# EAGLE design fade4 (EAGLE 9.6.2)

## Sheet 1 of 2
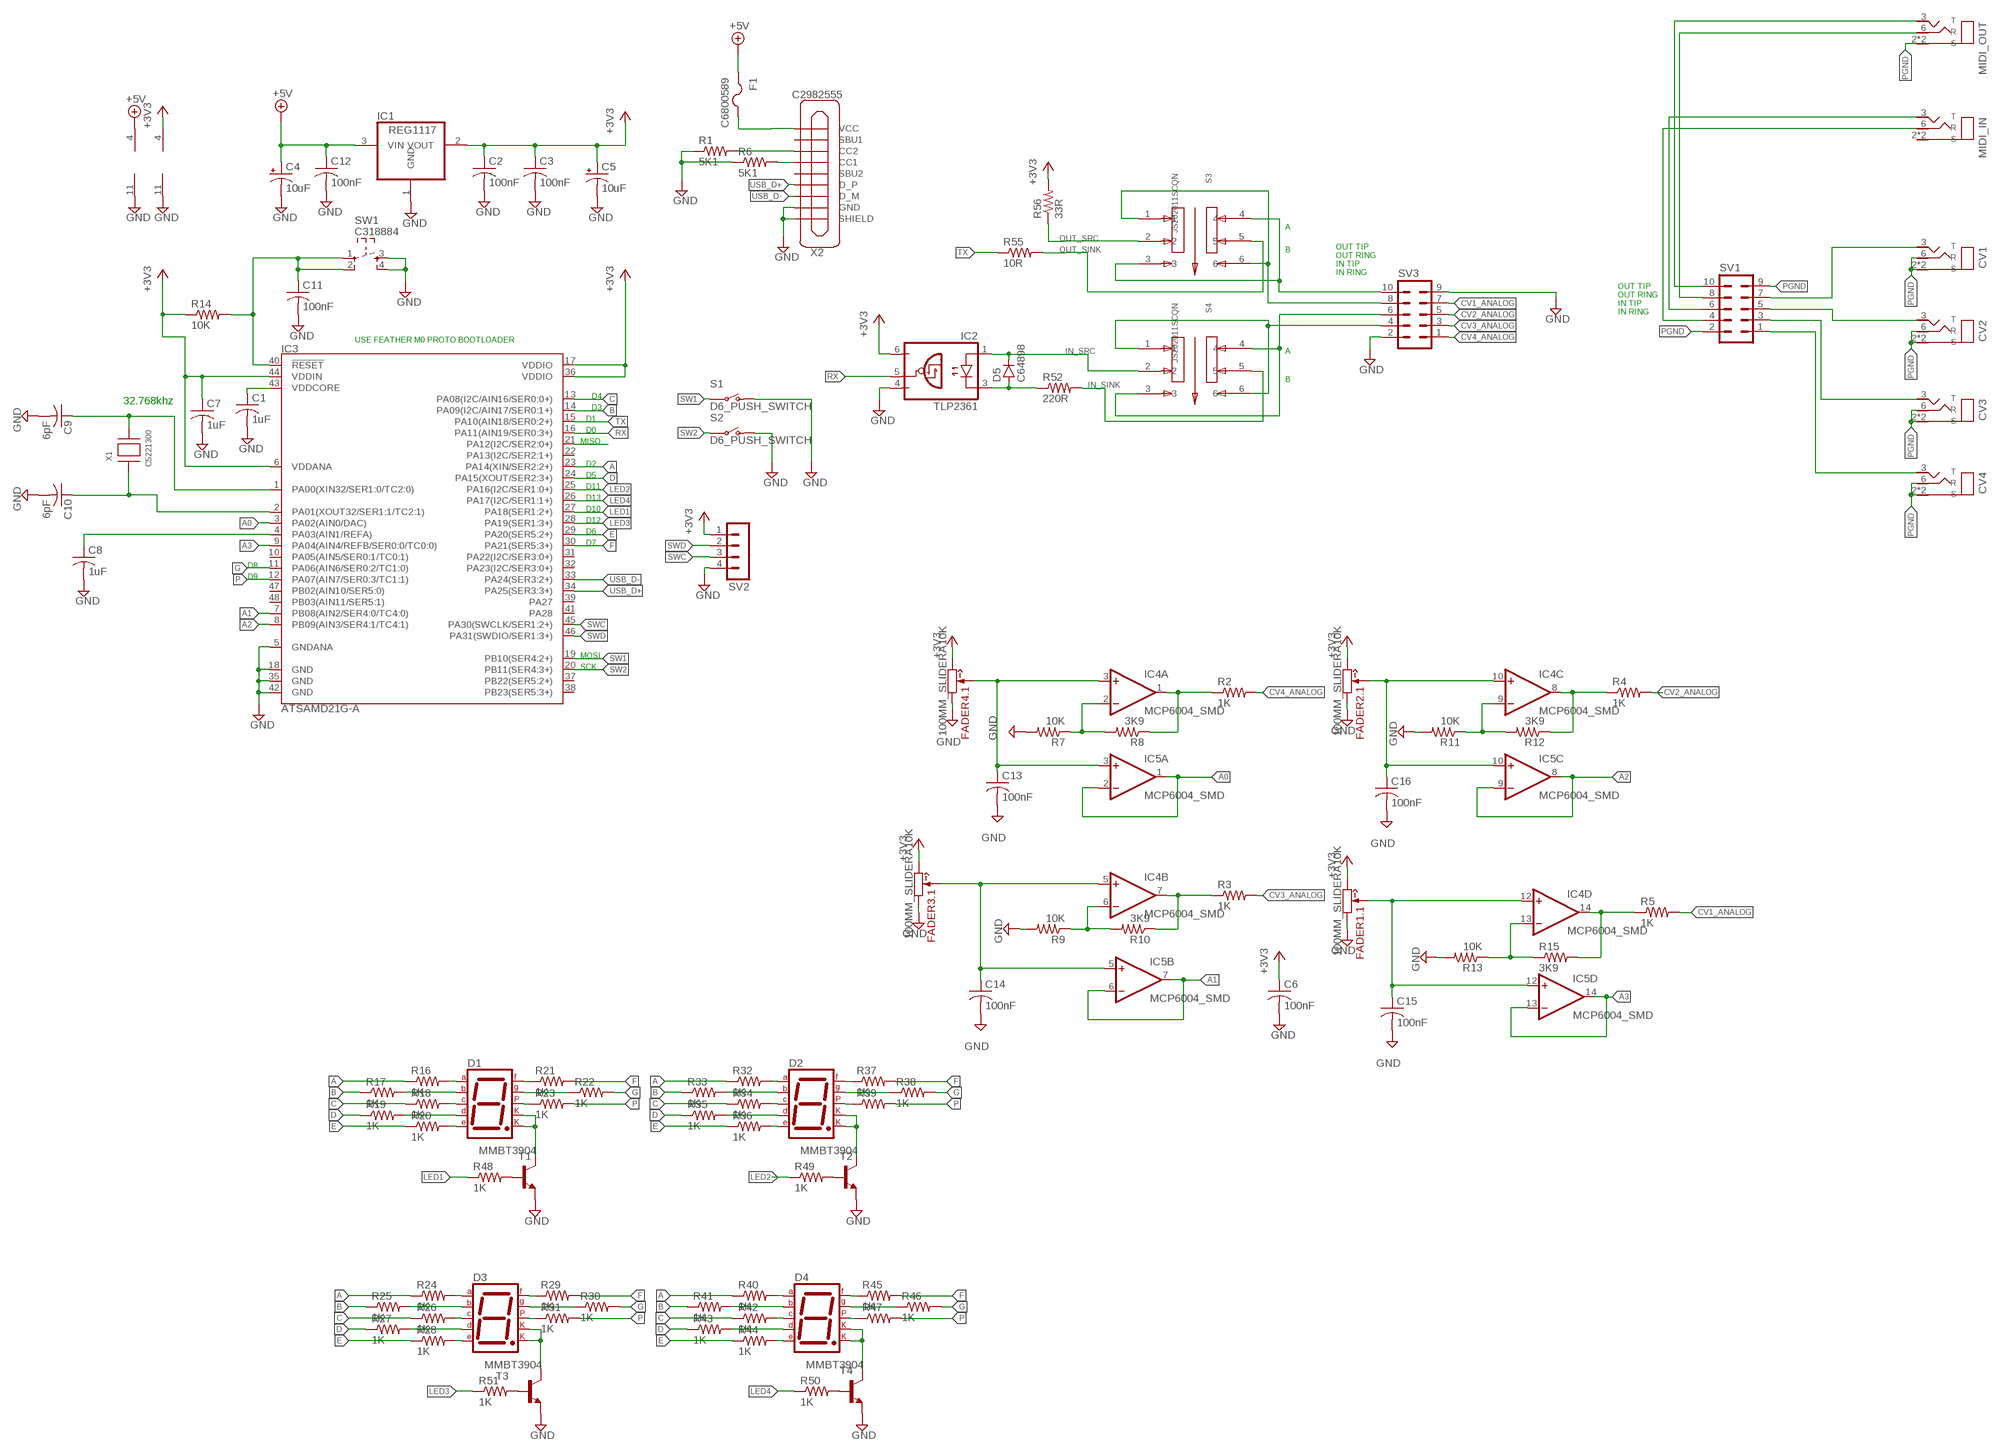
[diagram p0: schematic, sheet 1]

### Parts
C1  1uF  C-USC0603K  [C0603K]
C2  100nF  C-USC0603K  [C0603K]
C3  100nF  C-USC0603K  [C0603K]
C4  10uF  CPOL-USA/3216-18R  [A/3216-18R]
C5  10uF  CPOL-USA/3216-18R  [A/3216-18R]
C6  100nF  C-USC0603K  [C0603K]
C7  1uF  C-USC0603K  [C0603K]
C8  1uF  C-USC0603K  [C0603K]
C9  6pF  C-USC0603K  [C0603K]
C10  6pF  C-USC0603K  [C0603K]
C11  100nF  C-USC0603K  [C0603K]
C12  100nF  C-USC0603K  [C0603K]
C13  100nF  C-USC0603K  [C0603K]
C14  100nF  C-USC0603K  [C0603K]
C15  100nF  C-USC0603K  [C0603K]
C16  100nF  C-USC0603K  [C0603K]
CV1  C725772  [C725772]
CV2  C725772  [C725772]
CV3  C725772  [C725772]
CV4  C725772  [C725772]
D1  7SEG-CK  [7SEG-13]
D2  7SEG-CK  [7SEG-13]
D3  7SEG-CK  [7SEG-13]
D4  7SEG-CK  [7SEG-13]
D5  C64898  D-SOD123  [SOD123]
F1  C6800589  PTCFUSE-1206  [R1206]
FADER1  100MM_SLIDERA10K  [100MM-SLIDER]
FADER2  100MM_SLIDERA10K  [100MM-SLIDER]
FADER3  100MM_SLIDERA10K  [100MM-SLIDER]
FADER4  100MM_SLIDERA10K  [100MM-SLIDER]
IC1  REG1117  [SOT223]
IC2  TLP2361  [SOIC-5]
IC3  ATSAMD21G-A  [TQFP-48]
IC4  MCP6004_SMD  [SO14]
IC5  MCP6004_SMD  [SO14]
MIDI_IN  C725772  [C725772]
MIDI_OUT  C725772  [C725772]
R1  5K1  R-US_R0603  [R0603]
R2  1K  R-US_R0603  [R0603]
R3  1K  R-US_R0603  [R0603]
R4  1K  R-US_R0603  [R0603]
R5  1K  R-US_R0603  [R0603]
R6  5K1  R-US_R0603  [R0603]
R7  10K  R-US_R0603  [R0603]
R8  3K9  R-US_R0603  [R0603]
R9  10K  R-US_R0603  [R0603]
R10  3K9  R-US_R0603  [R0603]
R11  10K  R-US_R0603  [R0603]
R12  3K9  R-US_R0603  [R0603]
R13  10K  R-US_R0603  [R0603]
R14  10K  R-US_R0603  [R0603]
R15  3K9  R-US_R0603  [R0603]
R16  1K  R-US_R0603  [R0603]
R17  1K  R-US_R0603  [R0603]
R18  1K  R-US_R0603  [R0603]
R19  1K  R-US_R0603  [R0603]
R20  1K  R-US_R0603  [R0603]
R21  1K  R-US_R0603  [R0603]
R22  1K  R-US_R0603  [R0603]
R23  1K  R-US_R0603  [R0603]
R24  1K  R-US_R0603  [R0603]
R25  1K  R-US_R0603  [R0603]
R26  1K  R-US_R0603  [R0603]
R27  1K  R-US_R0603  [R0603]
R28  1K  R-US_R0603  [R0603]
R29  1K  R-US_R0603  [R0603]
R30  1K  R-US_R0603  [R0603]
R31  1K  R-US_R0603  [R0603]
R32  1K  R-US_R0603  [R0603]
R33  1K  R-US_R0603  [R0603]
R34  1K  R-US_R0603  [R0603]
R35  1K  R-US_R0603  [R0603]
R36  1K  R-US_R0603  [R0603]
R37  1K  R-US_R0603  [R0603]
R38  1K  R-US_R0603  [R0603]
R39  1K  R-US_R0603  [R0603]
R40  1K  R-US_R0603  [R0603]
R41  1K  R-US_R0603  [R0603]
R42  1K  R-US_R0603  [R0603]
R43  1K  R-US_R0603  [R0603]
R44  1K  R-US_R0603  [R0603]
R45  1K  R-US_R0603  [R0603]
R46  1K  R-US_R0603  [R0603]
R47  1K  R-US_R0603  [R0603]
R48  1K  R-US_R0603  [R0603]
R49  1K  R-US_R0603  [R0603]
R50  1K  R-US_R0603  [R0603]
R51  1K  R-US_R0603  [R0603]
R52  220R  R-US_R0603  [R0603]
R55  10R  R-US_R1206  [R1206]
R56  33R  R-US_R1206  [R1206]
S1  D6_PUSH_SWITCH  [D6_PUSH_SWITCH]
S2  D6_PUSH_SWITCH  [D6_PUSH_SWITCH]
S3  JS202011SCQN  [SW_JS202011SCQN]
S4  JS202011SCQN  [SW_JS202011SCQN]
SV1  MA05-2  [MA05-2]
SV2  MA04-1  [MA04-1]
SV3  MA05-2  [MA05-2]
SW1  C318884  SW_TACT_4P  [SW_TACT_SMALL]
T1  MMBT3904  MMBT3904LT1-NPN-SOT23-BEC  [SOT23-BEC]
T2  MMBT3904  MMBT3904LT1-NPN-SOT23-BEC  [SOT23-BEC]
T3  MMBT3904  MMBT3904LT1-NPN-SOT23-BEC  [SOT23-BEC]
T4  MMBT3904  MMBT3904LT1-NPN-SOT23-BEC  [SOT23-BEC]
X1  C5221300  XTAL-3.2X1.5  [XTAL3215]
X2  C2982555  [C2982555]

### Nets
+3V3: C2.1 C3.1 C5.+ C6.1 C7.1 FADER1.A3(.1:CW) FADER2.A3(.1:CW) FADER3.A3(.1:CW) FADER4.A3(.1:CW) IC1.2(VOUT) IC2.6(VCC) IC3.6(VDDANA) IC3.17(VDDIO) IC3.36(VDDIO) IC3.44(VDDIN) IC5.4(P:V+) R14.1 R56.2 SV2.1
+5V: C4.+ C12.1 F1.1 IC1.3(VIN) IC4.4(P:V+)
A: IC3.23(PA14(XIN/SER2:2+)) R16.1 R24.1 R32.1 R40.1
A0: IC3.3(PA02(AIN0/DAC)) IC5.1(A:OUT) IC5.2(A:-IN)
A1: IC3.7(PB08(AIN2/SER4:0/TC4:0)) IC5.6(B:-IN) IC5.7(B:OUT)
A2: IC3.8(PB09(AIN3/SER4:1/TC4:1)) IC5.8(C:OUT) IC5.9(C:-IN)
A3: IC3.9(PA04(AIN4/REFB/SER0:0/TC0:0)) IC5.13(D:-IN) IC5.14(D:OUT)
B: IC3.14(PA09(I2C/AIN17/SER0:1+)) R17.1 R25.1 R33.1 R41.1
C: IC3.13(PA08(I2C/AIN16/SER0:0+)) R18.1 R26.1 R34.1 R42.1
CV1_ANALOG: R5.2 SV3.7
CV2_ANALOG: R4.2 SV3.5
CV3_ANALOG: R3.2 SV3.3
CV4_ANALOG: R2.2 SV3.1
D: IC3.24(PA15(XOUT/SER2:3+)) R19.1 R27.1 R35.1 R43.1
E: IC3.29(PA20(SER5:2+)) R20.1 R28.1 R36.1 R44.1
F: IC3.30(PA21(SER5:3+)) R21.2 R29.2 R37.2 R45.2
G: IC3.11(PA06(AIN6/SER0:2/TC1:0)) R22.2 R30.2 R38.2 R46.2
GND: C1.2 C2.2 C3.2 C4.- C5.- C6.2 C7.2 C8.2 C9.2 C10.2 C11.2 C12.2 C13.2 C14.2 C15.2 C16.2 FADER1.A1(.1:CCW) FADER2.A1(.1:CCW) FADER3.A1(.1:CCW) FADER4.A1(.1:CCW) IC1.1(GND) IC2.4(GND) IC3.5(GNDANA) IC3.18(GND) IC3.35(GND) IC3.42(GND) IC4.11(P:V-) IC5.11(P:V-) R1.1 R6.1 R7.2 R9.2 R11.2 R13.2 S1.P$1(O) S1.P$2(O) S2.P$1(O) S2.P$2(O) SV2.4 SV3.2 SV3.9 SW1.3 SW1.4 T1.E T2.E T3.E T4.E X2.A12B1(GND) X2.B12A1(GND) X2.SHIELD1(SHIELD) X2.SHIELD2(SHIELD) X2.SHIELD3(SHIELD) X2.SHIELD4(SHIELD)
IN_RING: S4.1 S4.6 SV3.4
IN_SINK: R52.2 S4.5
IN_SRC: D5.1(C) IC2.1(A) S4.2
IN_TIP: S4.3 S4.4 SV3.6
LED1: IC3.27(PA18(SER1:2+)) R48.1
LED2: IC3.25(PA16(I2C/SER1:0+)) R49.1
LED3: IC3.28(PA19(SER1:3+)) R51.1
LED4: IC3.26(PA17(I2C/SER1:1+)) R50.1
N$1: R6.2 X2.A5(CC1)
N$2: R1.2 X2.B5(CC2)
N$3: C1.1 IC3.43(VDDCORE)
N$4: F1.2 X2.A9B4(VCC) X2.B9A4(VCC)
N$5: C13.1 FADER4.A2(.1:W) IC4.3(A:+IN) IC5.3(A:+IN)
N$6: C14.1 FADER3.A2(.1:W) IC4.5(B:+IN) IC5.5(B:+IN)
N$7: C16.1 FADER2.A2(.1:W) IC4.10(C:+IN) IC5.10(C:+IN)
N$8: C15.1 FADER1.A2(.1:W) IC4.12(D:+IN) IC5.12(D:+IN)
N$9: IC4.1(A:OUT) R2.1 R8.1
N$10: IC4.7(B:OUT) R3.1 R10.1
N$11: IC4.8(C:OUT) R4.1 R12.1
N$12: IC4.14(D:OUT) R5.1 R15.2
N$13: D1.7(A) R16.2
N$14: IC4.9(C:-IN) R11.1 R12.2
N$15: D1.6(B) R17.2
N$16: IC4.13(D:-IN) R13.1 R15.1
N$17: CV1.3(T) SV1.7
N$18: IC4.6(B:-IN) R9.1 R10.2
N$19: D1.4(C) R18.2
N$20: D1.2(D) R19.2
N$22: D1.1(E) R20.2
N$23: D3.7(A) R24.2
N$24: D3.6(B) R25.2
N$25: D3.4(C) R26.2
N$26: D3.2(D) R27.2
N$27: D1.9(F) R21.1
N$28: D1.10(G) R22.1
N$29: D1.5(DP) R23.1
N$30: IC3.21(PA12(I2C/SER2:0+))
N$31: D5.2(A) IC2.3(C) R52.1
N$33: D3.1(E) R28.2
N$34: D3.9(F) R29.1
N$35: D3.10(G) R30.1
N$36: D3.5(DP) R31.1
N$37: D2.7(A) R32.2
N$38: D2.6(B) R33.2
N$39: D2.4(C) R34.2
N$40: D2.2(D) R35.2
N$41: D2.1(E) R36.2
N$42: D2.9(F) R37.1
N$43: C8.1 IC3.4(PA03(AIN1/REFA))
N$44: C9.1 IC3.1(PA00(XIN32/SER1:0/TC2:0)) X1.P$2
N$45: C10.1 IC3.2(PA01(XOUT32/SER1:1/TC2:1)) X1.P$1
N$46: D2.10(G) R38.1
N$47: D2.5(DP) R39.1
N$48: D4.7(A) R40.2
N$49: D4.6(B) R41.2
N$50: D4.4(C) R42.2
N$51: D4.2(D) R43.2
N$52: D4.1(E) R44.2
N$53: D4.9(F) R45.1
N$54: D4.10(G) R46.1
N$55: D4.5(DP) R47.1
N$56: CV2.3(T) SV1.5
N$57: CV3.3(T) SV1.3
N$58: CV4.3(T) SV1.1
N$59: MIDI_OUT.3(T) SV1.10
N$60: MIDI_OUT.6(R) SV1.8
N$61: MIDI_IN.3(T) SV1.6
N$62: MIDI_IN.6(R) SV1.4
N$67: R48.2 T1.B
N$68: R49.2 T2.B
N$69: R50.2 T4.B
N$70: R51.2 T3.B
N$71: IC4.2(A:-IN) R7.1 R8.2
N$75: D3.3(CK1) D3.8(CK2) T3.C
N$77: D4.3(CK1) D4.8(CK2) T4.C
N$79: D2.3(CK1) D2.8(CK2) T2.C
N$81: D1.3(CK1) D1.8(CK2) T1.C
OUT_RING: S3.1 S3.6 SV3.8
OUT_SINK: R55.2 S3.5
OUT_SRC: R56.1 S3.2
OUT_TIP: S3.3 S3.4 SV3.10
P: IC3.12(PA07(AIN7/SER0:3/TC1:1)) R23.2 R31.2 R39.2 R47.2
PGND: CV1.2(S) CV1.5(S) CV1.6(R) CV2.2(S) CV2.5(S) CV2.6(R) CV3.2(S) CV3.5(S) CV3.6(R) CV4.2(S) CV4.5(S) CV4.6(R) MIDI_OUT.2(S) MIDI_OUT.5(S) SV1.2 SV1.9
RST_PCB: C11.1 IC3.40(!RESET!) R14.2 SW1.1 SW1.2
RX: IC2.5(VO) IC3.16(PA11(AIN19/SER0:3+))
SW1: IC3.19(PB10(SER4:2+)) S1.P$3(P) S1.P$4(P)
SW2: IC3.20(PB11(SER4:3+)) S2.P$3(P) S2.P$4(P)
SWC: IC3.45(PA30(SWCLK/SER1:2+)) SV2.3
SWD: IC3.46(PA31(SWDIO/SER1:3+)) SV2.2
TX: IC3.15(PA10(AIN18/SER0:2+)) R55.1
USB_D+: IC3.34(PA25(SER3:3+)) X2.A6(D_P) X2.B6(D_P)
USB_D-: IC3.33(PA24(SER3:2+)) X2.A7(D_M) X2.B7(D_M)
Unconnected: FADER1.B1(.2:CCW) FADER1.B2(.2:W) FADER1.B3(.2:CW) FADER2.B1(.2:CCW) FADER2.B2(.2:W) FADER2.B3(.2:CW) FADER3.B1(.2:CCW) FADER3.B2(.2:W) FADER3.B3(.2:CW) FADER4.B1(.2:CCW) FADER4.B2(.2:W) FADER4.B3(.2:CW) IC3.10(PA05(AIN5/SER0:1/TC0:1)) IC3.22(PA13(I2C/SER2:1+)) IC3.31(PA22(I2C/SER3:0+)) IC3.32(PA23(I2C/SER3:0+)) IC3.37(PB22(SER5:2+)) IC3.38(PB23(SER5:3+)) IC3.39(PA27) IC3.41(PA28) IC3.47(PB02(AIN10/SER5:0)) IC3.48(PB03(AIN11/SER5:1)) MIDI_IN.2(S) MIDI_IN.5(S) X2.A8(SBU1) X2.B8(SBU2)

### Notes on the sheet
- A
- B
- OUT TIP
  OUT RING
  IN TIP
  IN RING
- OUT TIP
  OUT RING
  IN TIP
  IN RING
- USE FEATHER M0 PROTO BOOTLOADER
- A
- B
- D4
- 32.768khz
- D3
- D1
- D0
- MISO
- D2
- D5
- D11
- D13
- D10
- D12
- D6
- D7
- D8
- D9
- MOSI
- SCK

## Sheet 2 of 2

## Library data of the parts
C1-C3 C6-C16 = rcl:C-US: CAPACITOR, American symbol; SPICEPREFIX: C
C4 C5 = adafruit:CPOL-US: POLARIZED CAPACITOR, American symbol
CV1-CV4 MIDI_IN MIDI_OUT = ptrz:C725772
D1-D4 = special:7SEG-CK: 7-segment DISPLAY single cathode, 13 mm
D5 = semicon-smd-ipc:D-: DIODE unfilled
F1 = adafruit:PTCFUSE: PTC fuses, resettable thermistors
FADER1-FADER4 = ptrz:100MM_SLIDER
IC1 = burr-brown:REG1117: 800mA and 1A Low Dropout (LDO) Positive Regulator 1.8V, 2.5V, 2.85V, 3.3V, 5V, and Adj; MPN: REG1117; OC_FARNELL: 1097566; OC_NEWARK: 14P6981
IC2 = ptrz:TLP2361
IC3 = SparkFun-IC-Microcontroller:ATSAMD21G: Atmel SAMD21G SMART ARM-Based Microcontroller The Atmel ® | SMART ™ SAM D21 is a series of low-power microcontrollers using the 32-bit ARM ® Cortex ® -M0+ processor, and ranging from 32- to 64-pins with up to 256KB Flash and 32KB of SRAM. The SAM D21 devices operate at a maximum frequency of 48MHz and reach 2.46 CoreMark/MHz. They are designed for simple and intuitive migration with identical peripheral modules, hex compatible code, identical linear address map and pin compatible migration paths between all devices in the product series. All devices include intelligent and flexible peripherals, Atmel Event System for inter-peripheral signaling, and support for capacitive touch button, slider and wheel user interfaces. Datasheet <https://cdn.sparkfun.com/datasheets/Dev/Arduino/Boards/Atmel-42181-SAM-D21_Datasheet.pdf> SparkFun Products SparkFun SAMD21 Mini Breakout <https://www.sparkfun.com/products/13664> (DEV-13664) SparkFun SAMD21 Dev Breakout <https://www.sparkfun.com/products/13672> (DEV-13672); PROD_ID: IC-13064
IC4 IC5 = MusicThingModular:MCP6004: Generic Quad Op Amp
R1-R52 R55 R56 = rcl:R-US_: RESISTOR, American symbol; SPICEPREFIX: R
S1 S2 = MusicThingModular:D6_PUSH_SWITCH: Push switch
S3 S4 = JS202011SCQN:JS202011SCQN: JS Series DPDT On-On Gull Wing Surface Mount Subminiature Slide Switch; AVAILABILITY: Unavailable; DESCRIPTION: Slide Switch DPDT Surface Mount; DIGIKEY-PURCHASE-URL: https://snapeda.com/shop?store=DigiKey&id=592122; MF: C&K; MP: JS202011SCQN; PACKAGE: None; PRICE: None
SV1 SV3 = con-lstb:MA05-2: PIN HEADER; OC_FARNELL: unknown; OC_NEWARK: unknown
SV2 = con-lstb:MA04-1: PIN HEADER; OC_FARNELL: unknown; OC_NEWARK: unknown
SW1 = dp_devices:SW_TACT_4P
T1-T4 = transistor:*-NPN-: NPN Transistror BF959 corrected 2008.03.06
X1 = adafruit:XTAL: Low cost SMT crystals, no capacitors included http://www.ladyada.net/library/eagle
X2 = ptrz:C2982555

## Net classes
0 default: width 0.254 mm, drill 0.254 mm, clearance 0.178 mm

## Board
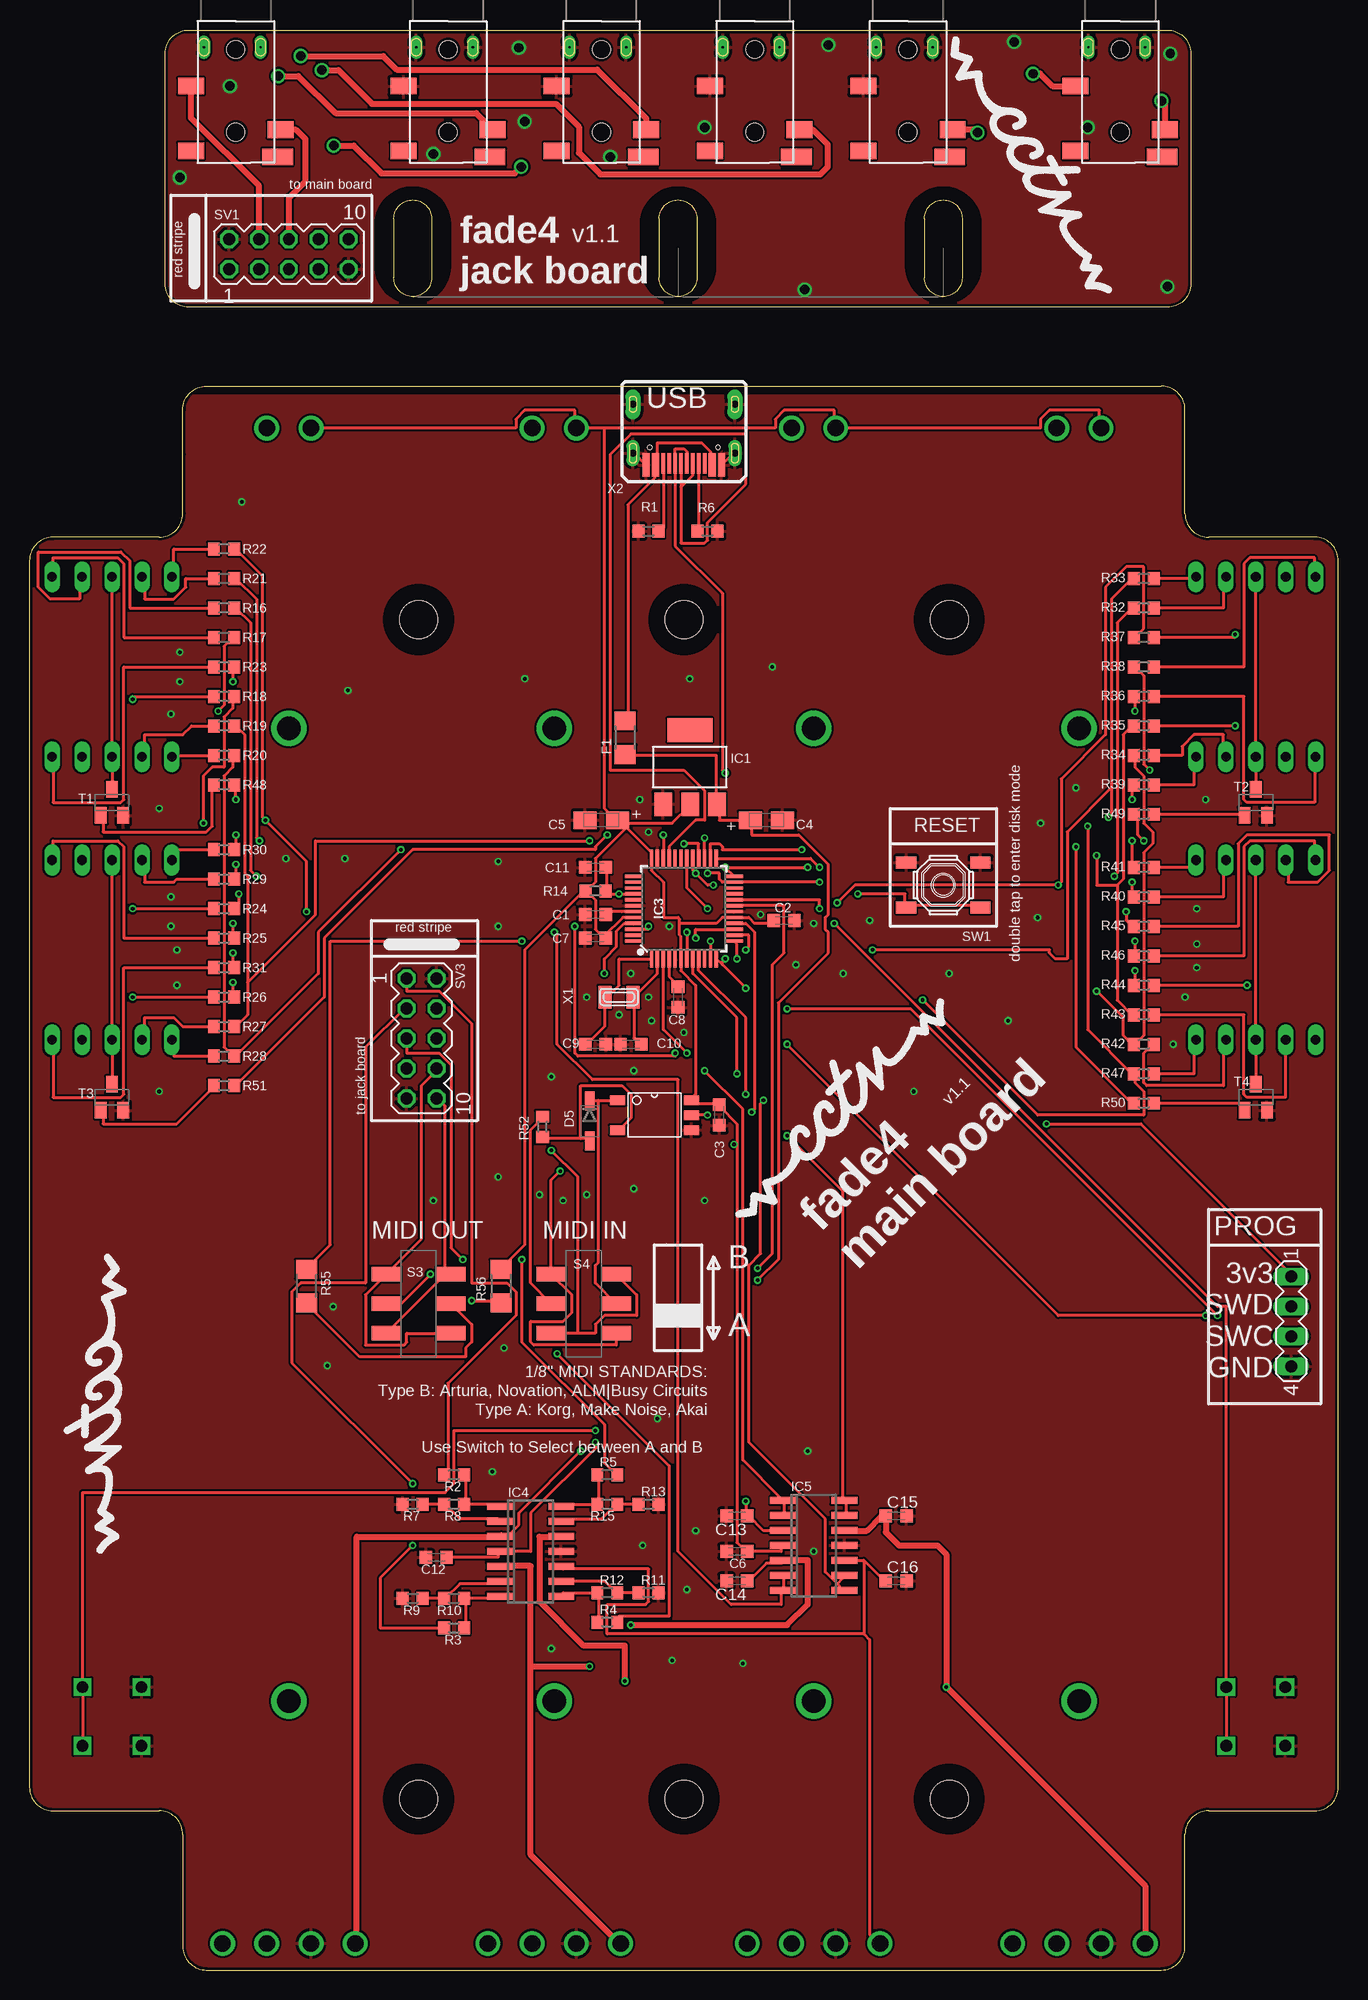
[diagram p1: board, top side]
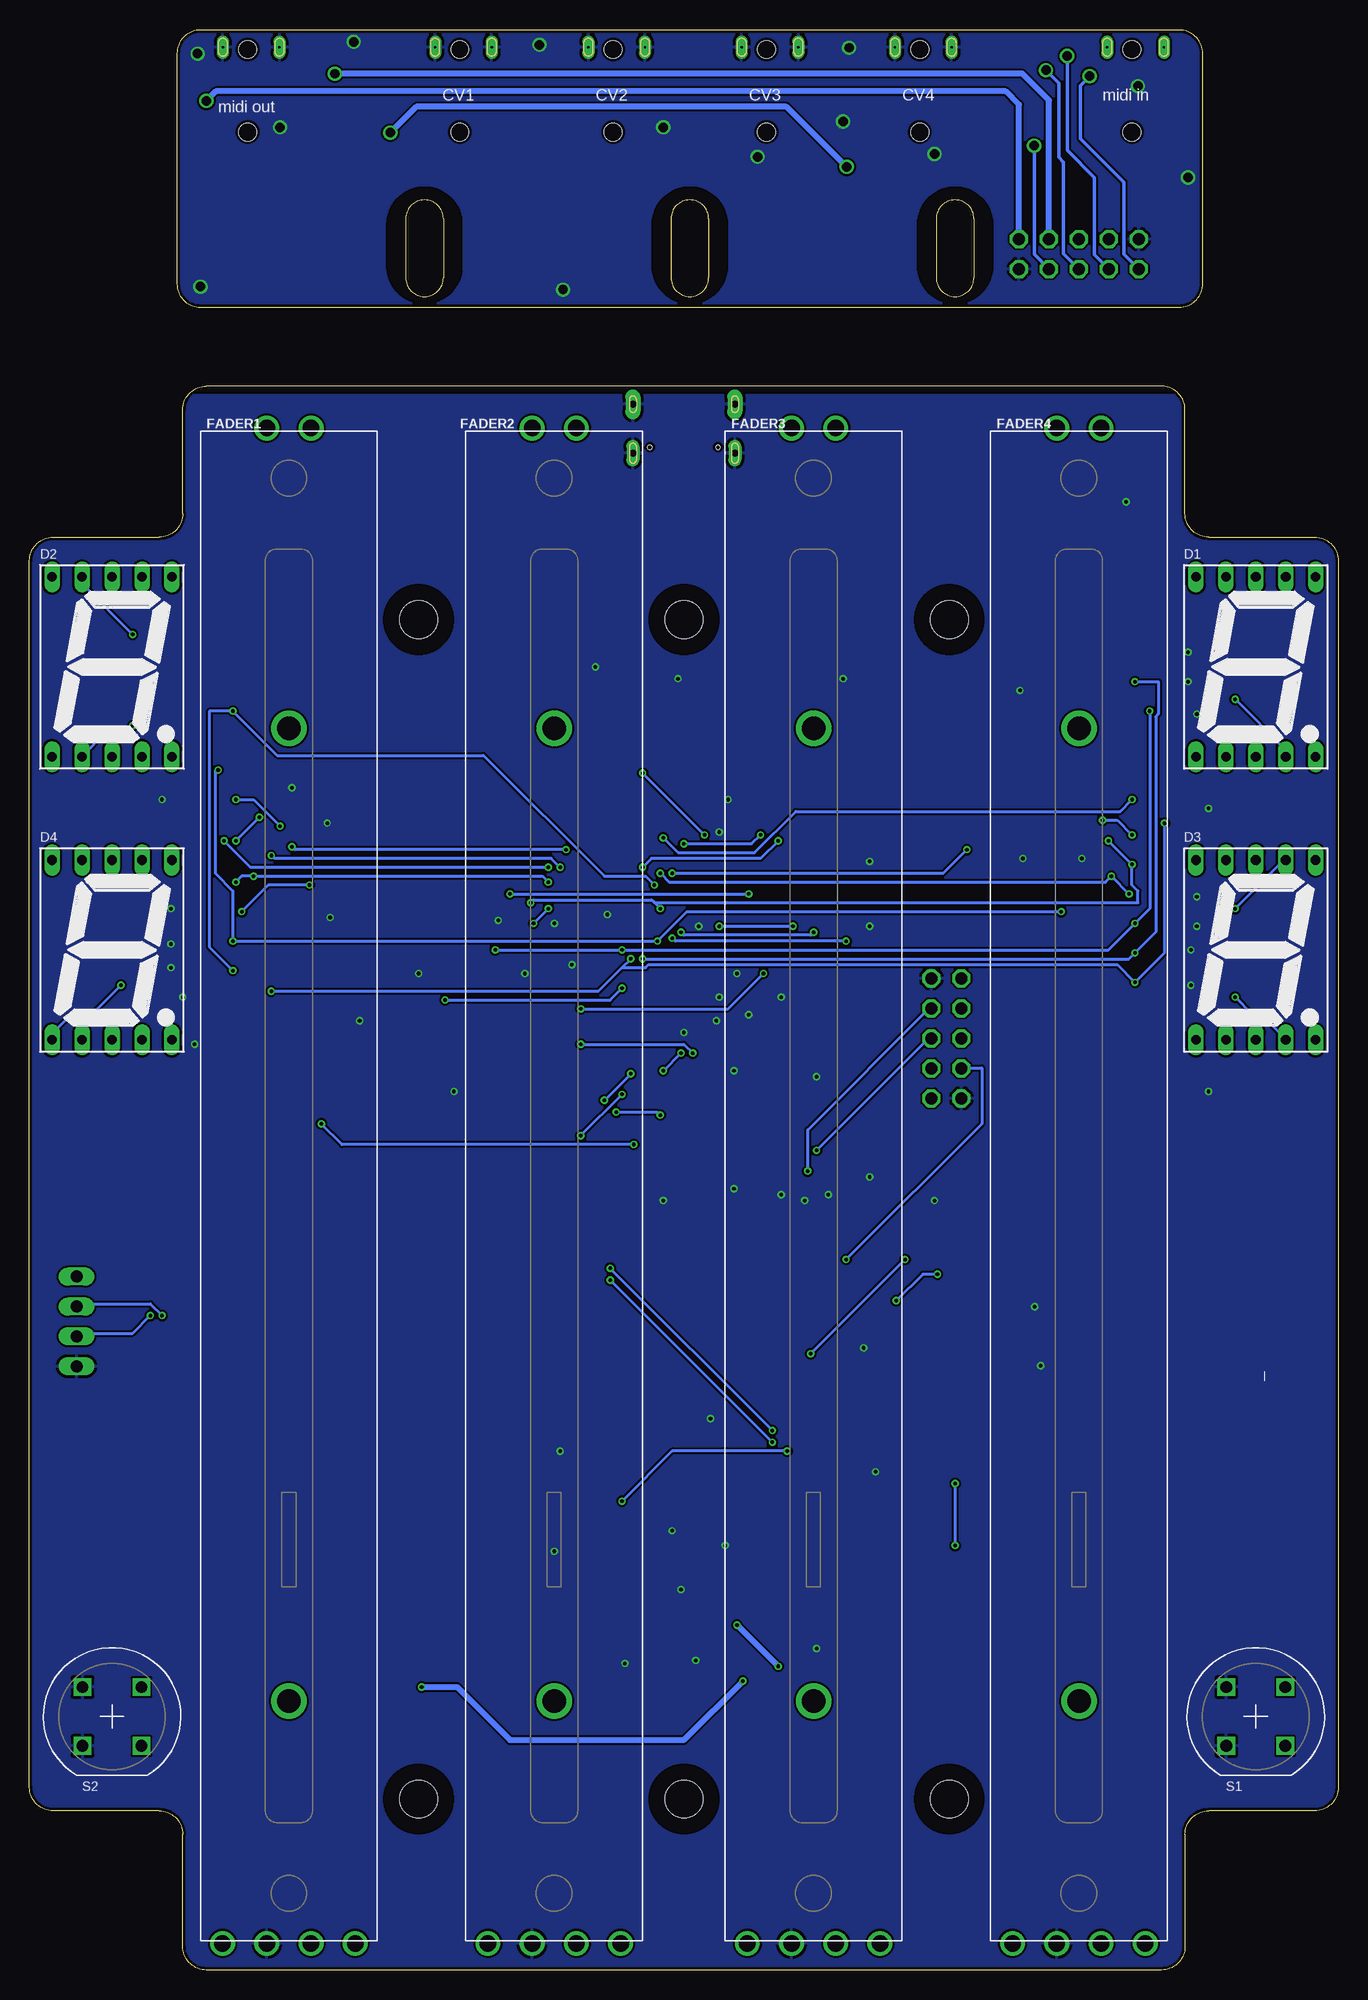
[diagram p2: board, bottom side, seen from below]

Size 111 x 164.5 mm. Coordinates in mm from the lower left corner, seen from the top.
Outline: 98,123.5 98,132.3 arc90 96,134.3 15,134.3 arc90 13,132.3 13,128.5 13,123.5 arc-90 11,121.5 2,121.5 arc90 0,119.5 0,15.5 arc90 2,13.5 11,13.5 arc-90 13,11.5 13,2 arc90 15,0 96,0 arc90 98,2 98,11.5 arc-90 100,13.5 109,13.5 arc90 111,15.5 111,119.5 arc90 109,121.5 100,121.5 arc-90 98,123.5
Outline: 13.5,164.5 96.5,164.5 arc-90 98.5,162.5 98.5,143 arc-90 96.5,141 13.5,141 arc-90 11.5,143 11.5,162.5 arc-90 13.5,164.5
Copper layers (1*16): Top 0.035mm / dielectric 1.5mm / Bottom 0.035mm
Design rules "dirt_cheap_dirty_boards.v1": minimum track width 5mil, minimum drill 12mil, track to track 5mil, track to pad 5mil, pad to pad 5mil, via to via 5mil, smd to smd 0mil, copper to edge 10mil, drill to drill 10mil, minimum pad ring 10mil, minimum via ring 6mil, stop-mask expansion 2mil, vias tented up to drill 25mil, thermal gap 10mil
Holes 3.2 mm at 33,114.5 78,114.5 55.5,114.5 33,14.5 55.5,14.5 78,14.5
tRestrict: area 31.2,112.8 to 34.8,116.2; area 53.8,112.8 to 57.2,116.2; area 76.2,112.8 to 79.8,116.2; area 31.2,12.8 to 34.8,16.2; area 53.8,12.8 to 57.2,16.2; area 76.2,12.8 to 79.8,16.2; 12 lines
bRestrict: area 31.2,112.8 to 34.8,116.2; area 53.8,112.8 to 57.2,116.2; area 76.2,112.8 to 79.8,116.2; area 31.2,12.8 to 34.8,16.2; area 53.8,12.8 to 57.2,16.2; area 76.2,12.8 to 79.8,16.2; 12 lines
Milling: 18 lines

### Footprints (pad centres in the part's own frame; a part is rotated, then mirrored left to right if it is on the bottom)
C0603K = smd 1.05 x 1.08: 1 -0.875,0; 2 0.875,0
A/3216-18R = smd 1.95 x 1.5: + 1.375,0; - -1.375,0
C725772 = drill 0.2 pad 1 long: 2 2.2,2.1; 5 2.2,-2.7 | smd 1.4 x 2.2: 3 9.2,3.79; 6 5.5,-3.79; 7 11,-3.79 | smd 1.4 x 2.6: 4 11.5,3.54 | hole 1.5: 2.4,0; 9.4,0
7SEG-13 = drill 0.813 long: 1 -5.08,-7.62; 2 -2.54,-7.62; 3 0,-7.62; 4 2.54,-7.62; 5 5.08,-7.62; 6 5.08,7.62; 7 2.54,7.62; 8 0,7.62; 9 -2.54,7.62; 10 -5.08,7.62
SOD123 = smd 1.6 x 0.8: 1 -1.7,0; 2 1.7,0
R1206 = smd 1.6 x 1.803: 1 -1.422,0; 2 1.422,0
100MM-SLIDER = drill 1.4: A1 -1.875,-64.25; A2 -5.625,-64.25; A3 -1.875,64.25; B1 1.875,-64.25; B2 5.625,-64.25; B3 1.875,64.25 | drill 2: S$1 0,-43.7; S$2 0,38.8
SOT223 = smd 1.499 x 2.007: 1 -2.261,-3.15; 2 0.025,-3.15; 3 2.311,-3.15 | smd 3.81 x 2.007: 4 0,3.15
SOIC-5 = smd 1.27 x 0.8: 1 -3.15,1.27; 3 -3.15,-1.27; 4 3.15,-1.27; 5 3.15,0; 6 3.15,1.27
TQFP-48 = smd 1.5 x 0.28: 1 -4.25,2.75; 2 -4.25,2.25; 3 -4.25,1.75; 4 -4.25,1.25; 5 -4.25,0.75; 6 -4.25,0.25; 7 -4.25,-0.25; 8 -4.25,-0.75; 9 -4.25,-1.25; 10 -4.25,-1.75; 11 -4.25,-2.25; 12 -4.25,-2.75; 25 4.25,-2.75; 26 4.25,-2.25; 27 4.25,-1.75; 28 4.25,-1.25; 29 4.25,-0.75; 30 4.25,-0.25; 31 4.25,0.25; 32 4.25,0.75; 33 4.25,1.25; 34 4.25,1.75; 35 4.25,2.25; 36 4.25,2.75 | smd 0.28 x 1.5: 13 -2.75,-4.25; 14 -2.25,-4.25; 15 -1.75,-4.25; 16 -1.25,-4.25; 17 -0.75,-4.25; 18 -0.25,-4.25; 19 0.25,-4.25; 20 0.75,-4.25; 21 1.25,-4.25; 22 1.75,-4.25; 23 2.25,-4.25; 24 2.75,-4.25; 37 2.75,4.25; 38 2.25,4.25; 39 1.75,4.25; 40 1.25,4.25; 41 0.75,4.25; 42 0.25,4.25; 43 -0.25,4.25; 44 -0.75,4.25; 45 -1.25,4.25; 46 -1.75,4.25; 47 -2.25,4.25; 48 -2.75,4.25
SO14 = smd 0.6 x 2.2: 1 -3.81,-2.6; 2 -2.54,-2.6; 3 -1.27,-2.6; 4 0,-2.6; 5 1.27,-2.6; 6 2.54,-2.6; 7 3.81,-2.6; 8 3.81,2.6; 9 2.54,2.6; 10 1.27,2.6; 11 0,2.6; 12 -1.27,2.6; 13 -2.54,2.6; 14 -3.81,2.6
R0603 = smd 1 x 1.1: 1 -0.85,0; 2 0.85,0
D6_PUSH_SWITCH = drill 1 square: P$1 -2.5,2.5; P$2 2.5,2.5; P$3 2.5,-2.5; P$4 -2.5,-2.5
SW_JS202011SCQN = smd 1.2 x 2.5: 1 -2.5,-2.75; 2 0,-2.75; 3 2.5,-2.75; 4 -2.5,2.75; 5 0,2.75; 6 2.5,2.75
MA05-2 = drill 1.016 octagon: 1 -5.08,-1.27; 2 -5.08,1.27; 3 -2.54,-1.27; 4 -2.54,1.27; 5 0,-1.27; 6 0,1.27; 7 2.54,-1.27; 8 2.54,1.27; 9 5.08,-1.27; 10 5.08,1.27
MA04-1 = drill 1.016 long: 1 -3.81,0; 2 -1.27,0; 3 1.27,0; 4 3.81,0
SW_TACT_SMALL = smd 1.7 x 1: 1 -3.15,1.9; 2 3.15,1.9; 3 -3.15,-1.9; 4 3.15,-1.9
SOT23-BEC = smd 1 x 1.4: B -0.95,-1.1; C 0,1.1; E 0.95,-1.1
XTAL3215 = smd 1.1 x 1.9: P$1 1.2,0; P$2 -1.2,0
C2982555 = smd 0.3 x 1.75: A5 -1.25,2.95; A6 -0.25,2.95; A7 0.25,2.95; A8 1.25,2.95; B5 1.75,2.95; B6 0.75,2.95; B7 -0.75,2.95; B8 -1.75,2.95 | smd 0.6 x 2: A9B4 2.4,3.075; A12B1 3.2,3.075; B9A4 -2.4,3.075; B12A1 -3.2,3.075 | drill 0.6 pad 1.016 long: SHIELD1 -4.32,2.075; SHIELD2 4.32,2.075 | drill 0.6 pad 1.27 long: SHIELD3 -4.32,-2.075; SHIELD4 4.32,-2.075 | hole 0.35: -2.89,1.575; 2.89,1.575

### Placement (x,y rotation side)
C1  48,89.5 180 top
C2  64,89 0 top
C3  58.5,72.5 270 top
C4  62.5,97.5 180 top
C5  48.5,97.5 0 top
C6  60,35.5 180 top
C7  48,87.5 180 top
C8  55,82.5 270 top
C9  48,78.5 0 top
C10  51,78.5 180 top
C11  48,93.5 180 top
C12  34.5,35 180 top
C13  60,38.5 180 top
C14  60,33 180 top
C15  73.5,38.5 0 top
C16  73.5,33 0 top
CV1  74.5,165.25 270 top
CV2  61.5,165.25 270 top
CV3  48.5,165.25 270 top
CV4  35.5,165.25 270 top
D1  7,110.5 0 bottom
D2  104,110.5 0 bottom
D3  7,86.5 0 bottom
D4  104,86.5 0 bottom
D5  47.5,72 270 top
F1  50.5,104.5 90 top
FADER1  89,66.5 0 bottom
FADER2  66.5,66.5 0 bottom
FADER3  44.5,66.5 0 bottom
FADER4  22,66.5 0 bottom
IC1  56,102 0 top
IC2  53,72.5 0 top
IC3  55.5,90 90 top
IC4  42.5,35.5 270 top
IC5  66.5,36 270 top
MIDI_IN  17.5,165.25 270 top
MIDI_OUT  92.5,165.25 270 top
R1  52.5,122 0 top
R2  36,42 180 top
R3  36,29 180 top
R4  49,29.5 0 top
R5  49,42 0 top
R6  57.5,122 180 top
R7  32.5,39.5 180 top
R8  36,39.5 180 top
R9  32.5,31.5 180 top
R10  36,31.5 180 top
R11  52.5,32 0 top
R12  49,32 0 top
R13  52.5,39.5 0 top
R14  48,91.5 0 top
R15  49,39.5 180 top
R16  16.5,115.5 180 top
R17  16.5,113 180 top
R18  16.5,108 180 top
R19  16.5,105.5 180 top
R20  16.5,103 180 top
R21  16.5,118 0 top
R22  16.5,120.5 0 top
R23  16.5,110.5 0 top
R24  16.5,90 180 top
R25  16.5,87.5 180 top
R26  16.5,82.5 180 top
R27  16.5,80 180 top
R28  16.5,77.5 180 top
R29  16.5,92.5 0 top
R30  16.5,95 0 top
R31  16.5,85 0 top
R32  94.5,115.5 0 top
R33  94.5,118 0 top
R34  94.5,103 0 top
R35  94.5,105.5 0 top
R36  94.5,108 0 top
R37  94.5,113 180 top
R38  94.5,110.5 180 top
R39  94.5,100.5 180 top
R40  94.5,91 0 top
R41  94.5,93.5 0 top
R42  94.5,78.5 0 top
R43  94.5,81 0 top
R44  94.5,83.5 0 top
R45  94.5,88.5 180 top
R46  94.5,86 180 top
R47  94.5,76 180 top
R48  16.5,100.5 180 top
R49  94.5,98 0 top
R50  94.5,73.5 0 top
R51  16.5,75 180 top
R52  43.5,71.5 90 top
R55  23.5,58 270 top
R56  40,58 90 top
S1  7,21.5 90 bottom
S2  104,21.5 90 bottom
S3  33,56.5 270 top
S4  47,56.5 90 top
SV1  22,145.5 0 top
SV2  107,55 270 top
SV3  33.25,79 270 top
SW1  77.5,92 180 top
T1  7,99 0 top
T2  104,99 0 top
T3  7,74 0 top
T4  104,74 0 top
X1  50,82.5 0 top
X2  55.5,130.7 180 top

### Tracks (layer width: path | path; a pad name or v marks a point on that pad's centre or on a via)
+3V3  (via drill 0.3)
  Top 0.254: FADER4.A3 24,130.75 41.25,130.75 41.25,131.5 42,132.25 46.25,132.25 46.25,130.75 FADER3.A3 46.5,130.75 48.75,130.75 | FADER1.A3 90.75,130.75 90.75,132.25 86.5,132.25 85.75,131.5 85.75,130.75 68.5,130.75 FADER2.A3 68.25,130.75 68.25,132.25 64,132.25 63.25,131.5 63.25,130.75 48.75,130.75 | 48.62,87.62 48,88.25 48,90.75 47.25,91.5 | 48.62,87.62 48.75,87.5 C7.1 | 47.25,91.5 R14.1 | R56.2 40,59.5 42,61.5 42,86.5 47,91.5 R14.1 | IC5.4 63.75,36 63.75,35.5 61,35.5 C6.1 60.75,35.5 60,36.25 60,70 | C2.1 63,89 62.75,88.75 61.5,88.75 61,89.25 IC3.17 58.75,89.25 58.25,88.75 55.14,88.75 | 50.5,97 52.75,94.75 IC3.36 52.75,93.25 53.75,92.25 53.75,89.25 55,89.25 55.14,89.11 55.14,88.75 | 50.5,97 50.25,97.25 | 50.25,97.25 50,97.5 C5.+ | 50.25,97.25 54.5,97.25 56,98.75 IC1.2 | 50.5,97 C5.+ | 60,70 60,71.75 58.5,73.25 C3.1 58.5,73.5 56.25,73.5 56.25,73.75 IC2.6 56.25,74 56.5,74.25 56.5,83.5 55.25,84.75 IC3.6 55.25,87.64 55.14,87.75 55.14,88.75 | v86.25,71.75 94.25,71.75 107,59 SV2.1 | 60,70 v59.75,70 | 47.25,91.5 48,92.25 48,94.25 50.5,96.75 50.5,97 | 47.25,91.5 R14.1 | 50.5,97 C5.+ | 48.75,130.75 48.75,98.5 49.75,97.5 C5.+ | IC3.44 50.32,89.25 48.69,87.62 48.62,87.62
  Bottom 0.254: v86.25,71.75 84.5,70 v59.75,70
+5V  (via drill 0.3)
  Top 0.254: C12.1 35.5,35 39.75,35 39.75,35.5 IC4.4 40,35.5 42.5,35.5 42.5,38.75 48,44.25 v48,44.75 | F1.1 50.5,103 58.25,103 58.25,99 IC1.3 58.5,98.75 58.5,97.5 61,97.5 C4.+ 61.25,97.5 61.25,96.25 65.25,96.25 67.75,93.75 67.75,89.5 67.5,89.25 67.5,88.25 67.75,88 67.75,86.25 63.5,82 63.5,60.25 v61.75,58.5
  Bottom 0.254: v61.75,58.5 v48,44.75
A  (via drill 0.3)
  Top 0.254: v17.75,91.25 17.75,90.25 17.5,90 R24.1 | v19.25,92.75 18.75,93.25 18.75,114.25 17.5,115.5 R16.1 | v93.5,92.25 93.5,91 R40.1 | v92,92.75 92.25,93 92.25,114.25 93.5,115.5 R32.1 | v67,92.25 IC3.23 58.75,92.25 58.5,92.5 58.5,93 v57.5,93
  Bottom 0.254: v17.75,91.25 v19.25,92.75 19.75,92.25 56.75,92.25 v57.5,93 | v93.5,92.25 93,92.75 v92,92.75 67.5,92.75 v67,92.25
A0  (via drill 0.3)
  Top 0.254: IC3.3 53.75,79.75 v55.75,77.75 | v57.25,76.25 60.5,73 60.5,43.25 63.75,40 IC5.1 64,39.75 64,38.75 IC5.2
  Bottom 0.254: v57.25,76.25 v55.75,77.75
A1  (via drill 0.3)
  Top 0.254: v55.75,88 IC3.7 | v44.5,88 44.75,87.75 44.75,78.5 47.75,75.5 55,75.5 55,35.5 59.5,31 63.75,31 63.75,32 IC5.7 64,32.25 64,33.25 IC5.6
  Bottom 0.254: v55.75,88 55.5,87.75 44.75,87.75 v44.5,88
A2  (via drill 0.3)
  Top 0.254: IC3.8 56.25,84.5 60,80.75 v60,76 | v62.25,73.75 62,73.5 62,60.75 61,59.75 61,44.75 67.5,38.25 67.5,33.75 68.5,32.75 | 68.5,32.75 69,32.25 IC5.8 | 68.5,32.75 69,33.25 IC5.9
  Bottom 0.254: v62.25,73.75 v60,76
A3  (via drill 0.3)
  Top 0.254: IC3.9 56.75,84.75 60.75,80.75 v60.75,74.25 | v64.25,70.75 69,66 69,40 IC5.14 69.25,39.75 69.25,38.75 IC5.13
  Bottom 0.254: v64.25,70.75 v60.75,74.25
B  (via drill 0.3)
  Top 0.254: v17.25,88.75 17.25,87.5 R25.1 | v16,106.75 16.5,107.25 16.5,112.25 17.25,113 R17.1 | v93.5,95.75 93.5,93.5 R41.1 | v91.5,97.75 91.75,98 91.75,100.25 | 91.75,100.25 91.75,116.25 93.5,118 R33.1 | IC3.14 61,87.75 61,86.75 v60.75,86.5 | v71.5,86.5 86.5,86.5 86.5,86.25 87,85.75 88,85.75 88,96.5 91.75,100.25
  Bottom 0.254: v16,106.75 16,90 v17.25,88.75 19.5,86.5 v60.75,86.5 v71.5,86.5 | v91.5,97.75 v93.5,95.75
C  (via drill 0.3)
  Top 0.254: v17.25,83.75 17.25,82.5 R26.1 | v14.75,97.25 14.75,101.25 15.5,102 16.5,102 16.5,106.25 17.25,107 17.25,108 R18.1 | R34.1 93.75,103 93.75,102 94.5,101.25 94.5,97.25 95.25,96.5 95.25,95.5 94.5,94.75 94.5,79.25 93.75,78.5 R42.1 93.5,78.5 92.75,79.25 92.75,80.75 v90.5,83 | IC3.13 60,87 v60,85.75
  Bottom 0.254: v14.75,97.25 14.75,86.25 v17.25,83.75 18.75,85.25 58.5,85.25 58.75,85 60.75,85 | 60.75,85 62.75,83 v90.5,83 | 60.75,85 v60,85.75
CV1_ANALOG  (via drill 0.3)
  Top 0.254: v41.75,60.25 41.75,53.25 48.75,46.25 48.75,43 49.75,42 R5.2
  Bottom 0.254: v41.75,60.25 30.25,71.75 30.25,76.5 31.75,76.5 SV3.7
CV2_ANALOG  (via drill 0.3)
  Top 0.254: v44.75,52.25 54.25,42.75 54.25,30 50,30 49.85,29.85 R4.2 | v36.75,60.25 35.75,61.25 35.75,76.75 34.75,77.75 32,77.75 32,79 SV3.5
  Bottom 0.254: v36.75,60.25 v44.75,52.25
CV3_ANALOG  (via drill 0.3)
  Top 0.254: v32.5,36 29.75,33.25 29.75,29 35,29 R3.2 | v32.5,41.25 22.25,51.5 22.25,57.5 23,58.25 28.5,58.25 28.5,78.25 31.75,81.5 SV3.3
  Bottom 0.254: v32.5,41.25 v32.5,36
CV4_ANALOG
  Top 0.254: R2.2 35.25,42 35.5,42.25 35.5,49.75 41.25,55.5 41.25,57.5 40.5,58.25 37.5,58.25 37.5,80.25 34.75,83 32,83 32,84 SV3.1
D  (via drill 0.3)
  Top 0.254: 92.25,92 92.25,82.25 93.5,81 R43.1 | 92.25,92 92.75,92.5 92.75,104.75 93.5,105.5 R35.1 | 18.5,83.75 18.5,92.75 18.25,93 18.25,104.75 17.5,105.5 R19.1 | 18.5,83.75 18.5,81 17.5,80 R27.1 | IC3.24 v59,93.5 v66,93.5 | v47.5,95.75 24.25,95.75 24.25,89.5 18.5,83.75 | 92.25,92 90.5,92 v90.5,94.5
  Bottom 0.254: v59,93.5 58.25,94.25 49,94.25 v47.5,95.75 | v90.5,94.5 90.25,94.25 66.75,94.25 v66,93.5
E  (via drill 0.3)
  Top 0.254: R20.1 17.25,103 17.25,102 16.5,101.25 16.5,78.25 17.25,77.5 R28.1 17.5,77.5 24.5,84.5 24.5,88 v31.5,95 | v93.75,84.75 93.75,83.5 R44.1 | v93.75,106.75 93.75,108 R36.1 | IC3.29 56.25,93.25 v56.5,93 57.5,92 v58,92
  Bottom 0.254: v93.75,84.75 95.75,86.75 95.75,106.75 v93.75,106.75 90,103 72.5,103 62.25,92.75 58.75,92.75 v58,92 | v31.5,95 33.5,93 v56.5,93
F  (via drill 0.3)
  Top 0.254: v17.5,93.75 17.5,92.5 R29.2 | v19.5,95.75 19.25,96 19.25,116.25 17.5,118 R21.2 | v93,89.75 93,89 93.5,88.5 R45.2 | R37.2 93.75,113 94.5,113.75 94.5,119 93,119 91.25,117.25 91.25,104.75 87.5,101 87.5,92.25 v87.25,92 70,92 v68.5,90.5 | IC3.30 55.75,91.75 v57.5,90
  Bottom 0.254: v19.5,95.75 v17.5,93.75 17.5,92 17,91.5 17,90.5 58,90.5 | v93,89.75 90.75,92 v87.25,92 | 58,90.5 58.25,90.75 68.25,90.75 v68.5,90.5 | 58,90.5 v57.5,90
G  (via drill 0.3)
  Top 0.254: v17.5,96.25 17.5,95 R30.2 | R22.2 17.5,120.5 19.75,118.25 19.75,97.75 v20,97.5 23.5,94 v23.5,89.75 | v93.75,87.25 93.75,86 R46.2 | v95,101.75 94.5,102.25 94.5,109.75 93.75,110.5 R38.2 | v57.75,87.25 IC3.11
  Bottom 0.254: v17.5,96.25 18.75,97.5 v20,97.5 | v95,101.75 95.25,101.75 95.25,93 93.75,91.5 v93.75,87.25 v57.75,87.25 55.25,89.75 v23.5,89.75
GND  (via drill 0.3)
  Top 0.254: X2.A12B1 51.3,128.62 X2.SHIELD2 | X2.B12A1 59.7,128.62 X2.SHIELD1
  other vias: 11,74.5 11,98.5 12,106.5 18,124.5 27,108.5 42,109.5 56,109.5 63,110.5 69,84.5 78,84.5 83,80.5 75,74.5 71.25,89 85.5,89.25 85.75,97.25 65,85.25 39.75,94 39.75,88.5 51,84.5 55.5,79.5 47.25,82.5 54.25,88.5 62,89.5 66.5,88.75 50,81 52.75,80.5 52.5,82.5 52,36 56.5,37.25 55.75,32.25 66,44 66.5,35.5 60.5,26 54.5,26.25 44.25,27.25 52.5,96.5 51.75,99.25 53.25,46.75 25.25,51.25 25.75,56.25 51.25,66.25 57.25,65.25 45.25,65.25 39.75,67.25 34.25,65.25 44.25,75.75 51.25,76.25 47.25,65.75 43.25,65.75 39.25,42.25 40.25,52.75 88.75,100.25 99.75,99.25 26.75,94.25 21.75,94.25 12.75,109.25 12.75,111.75 12,91 12,88.5 12.5,86.5 12.5,83.5 99,90 99,87 99,85 98,82.5 97,78.5
  pour Bottom: 7,133.5 103,133.5 104,132.5 104,127.5 106,125.5 111,125.5 112,124.5 112,5.5 111,4.5 105,4.5 104,3.5 104,-2.5 103,-3.5 8,-3.5 7,-2.5 7,3.5 6,4.5 0,4.5 -1,5.5 -1,124.5 0,125.5 6,125.5 7,126.5
  pour Top: 7,133.5 103,133.5 104,132.5 104,127.5 106,125.5 111,125.5 112,124.5 112,5.5 111,4.5 105,4.5 104,3.5 104,-2.5 103,-3.5 8,-3.5 7,-2.5 7,3.5 6,4.5 0,4.5 -1,5.5 -1,124.5 0,125.5 6,125.5 7,126.5
IN_RING  (via drill 0.3)
  Top 0.254: S4.1 49.75,53 42.75,53 42.5,53.25 42.5,55 45.25,55 46,55.75 46,57.25 S4.6 44.25,67 v45,67.75
  Bottom 0.254: v45,67.75 45,71.25 34.75,81.5 SV3.4
IN_SINK
  Top 0.254: S4.5 42.5,58.25 42.5,71.25 43.5,72.25 R52.2
IN_SRC
  Top 0.254: 48.25,73.75 47.5,73.75 D5.1 | 48.25,73.75 49.75,73.75 IC2.1 | 48.25,73.75 48.25,60 48,59.75 48,58.25 S4.2
IN_TIP  (via drill 0.3)
  Top 0.254: 46.5,54 48,54 48,54.75 48.75,55.5 51.5,55.5 51.5,57.25 S4.3 | 46.5,54 S4.4 | v44.25,69.5 46.5,67.25 46.5,54
  Bottom 0.254: v44.25,69.5 34.75,79 SV3.6
LED1  (via drill 0.3)
  Top 0.254: v17.5,99.25 17.5,100.5 R48.1 | IC3.27 v57.25,96
  Bottom 0.254: v17.5,99.25 18.5,98.25 46,98.25 49.5,94.75 56,94.75 v57.25,96
LED2  (via drill 0.3)
  Top 0.254: v94.5,95.75 94,96.25 94,97.75 93.75,98 R49.1 | v67,93.5 66.25,94.25 IC3.25
  Bottom 0.254: v94.5,95.75 92.25,93.5 v67,93.5
LED3  (via drill 0.3)
  Top 0.254: v49,96.25 48,95.25 48,95 32.5,95 25,87.5 25,82.5 17.5,75 R51.1 | v55.5,95.5 56.75,95.5 IC3.28
  Bottom 0.254: v49,96.25 49.75,95.5 v55.5,95.5
LED4  (via drill 0.3)
  Top 0.254: v88.75,95.25 88.75,78.25 93.5,73.5 R50.1 | v65.5,95 58.75,95 58.75,95.25 58.5,95.5 57.75,95.5 IC3.26
  Bottom 0.254: v88.75,95.25 88.5,95 v65.5,95
N$1
  Top 0.254: X2.A5 56.75,122 R6.2
N$2
  Top 0.254: X2.B5 53.75,122.25 53.5,122 R1.2
N$3
  Top 0.254: IC3.43 50.25,89.75 49.25,89.75 49,89.5 C1.1
N$4
  Top 0.254: F1.2 50.5,106 50.75,106.25 50.75,124.25 53,126.5 53,127.5 X2.A9B4 53.25,127.75 53.25,129.5 57,129.5 57.75,128.75 57.75,127.75 X2.B9A4
N$5  (via drill 0.3)
  Top 0.254: IC5.3 63.75,37.25 62.25,37.25 61,38.5 C13.1 60.75,38.5 v60.75,39.75 | 39.75,36.75 IC4.3 40,37 40.75,37 41.5,37.75 41.5,38.75 v46.75,44 | 27.75,2.25 FADER4.A2
  Top 0.5: 39.75,36.75 27.75,36.75 27.75,2.25
  Bottom 0.254: v60.75,39.75 56.5,44 v46.75,44
N$6  (via drill 0.3)
  Top 0.254: C14.1 61,33 62.5,34.5 63.75,34.5 IC5.5 | 50,2.25 FADER3.A2
  Top 0.5: IC4.5 39.92,34.25 42.5,34.25 42.5,25.75 | 42.5,25.75 42.5,9.75 50,2.25 | IC5.5 63.92,34.75 66,34.75 66,31 64.25,29.25 v51,29.25 | 42.5,25.75 v47.5,25.75
  Bottom 0.5: v47.5,25.75 v51,29.25
N$7
  Top 0.254: 70.75,34.75 72.5,33 C16.1 | 70.75,34.75 69.25,34.75 IC5.10 | 70.75,28.5 49,28.5 49,31 52.25,31 52.5,31.25 52.5,34 45.25,34 IC4.10 | 70.75,34.75 70.75,28.5 | 70.75,28.5 71.25,28 71.25,3 72,2.25 FADER2.A2
N$8  (via drill 0.3)
  Top 0.254: 72.25,38.5 C15.1 | 69.25,37.25 IC5.12 | 45,36.75 IC4.12
  Top 0.5: 72.25,38.5 71,37.25 69.25,37.25 | 45,36.75 43.25,36.75 43.25,31.25 47,27.5 50.5,27.5 v50.5,24.5 | C15.1 72.62,37.12 73.75,36 77,36 77.75,35.25 v77.75,24 94.62,7.12 FADER1.A2
  Bottom 0.5: v77.75,24 74.75,24 70.25,19.5 55.5,19.5 v50.5,24.5
N$9
  Top 0.254: 37,39.5 37,42 R2.1 | 37,39.5 R8.1 37,39.5 | 37,39.5 39.75,39.5 IC4.1
N$10
  Top 0.254: 37,31.5 37,29 R3.1 | 37,31.5 R10.1 37,31.5 | 37,31.5 39.75,31.5 IC4.7
N$11
  Top 0.254: R4.1 48.25,29.5 48.25,32 R12.1 48,32 45.25,32 45.25,31.75 IC4.8
N$12
  Top 0.254: R5.1 48.25,42 48.25,39.5 R15.2 48,39.5 45.25,39.5 IC4.14
N$13
  Top 0.254: R16.2 15.5,115.5 8.5,115.5 8.5,119.5 7.75,120.25 0.75,120.25 0.75,117.25 1.75,116.25 4.25,116.25 4.25,118 D1.7
N$14
  Top 0.254: R11.1 51.5,32 50,32 R12.2 49.75,32 48.75,33 45.25,33 IC4.9
N$15
  Top 0.254: R17.2 15.5,113 8,113 8,119.25 7.5,119.75 2,119.75 2,118.25 D1.6
N$16
  Top 0.254: R13.1 51.5,39.5 50,39.5 R15.1 49.75,39.5 48.5,38.25 45.25,38.25 IC4.13
N$17  (via drill 0.8)
  Top 0.5: v25.8,154.7 27.5,154.7 29.85,152.35 41.15,152.35 v41.7,152.9 | v80.4,155.8 80.15,156.05 CV1.3
  Bottom 0.3: SV1.7 25.8,145.49 v25.8,154.7
  Bottom 0.5: v41.7,152.9 46.8,158 78.2,158 v80.4,155.8
N$18
  Top 0.254: R9.1 33.5,31.5 35,31.5 R10.2 35.25,31.5 36.5,32.75 39.75,32.75 IC4.6
N$19  (via drill 0.3)
  Top 0.254: v8.75,107.75 8.75,108 15.5,108 R18.2
  Bottom 0.254: v8.75,107.75 4.5,103.5 4.5,103 D1.4
N$20
  Top 0.254: R19.2 15.5,105.5 13.75,105.5 13,104.75 9.75,104.75 9.75,103 D1.2
N$22
  Top 0.254: R20.2 15.5,103 12.25,103 D1.1
N$23  (via drill 0.3)
  Top 0.254: v8.75,90 15.5,90 R24.2
  Bottom 0.254: v8.75,90 4.75,94 4.5,94 D3.7
N$24
  Top 0.254: R25.2 15.5,87.5 8,87.5 8,95.25 7.5,95.75 2,95.75 2,94.25 D3.6
N$25  (via drill 0.3)
  Top 0.254: v8.75,82.5 15.5,82.5 R26.2
  Bottom 0.254: v8.75,82.5 7.25,81 6.5,81 4.5,79 D3.4
N$26
  Top 0.254: R27.2 15.5,80 13,80 12.25,80.75 9.75,80.75 9.75,79 D3.2
N$27
  Top 0.254: R21.1 15.5,118 13.25,118 13.25,117.25 12.25,116.25 9.75,116.25 9.75,118 D1.9
N$28
  Top 0.254: R22.1 15.5,120.5 12.25,120.5 12.25,118.25 D1.10
N$29
  Top 0.254: R23.1 15.5,110.5 8,110.5 8,99.25 7.75,99 2,99 2,102.75 D1.5
N$31
  Top 0.254: 46.75,70.5 47.5,70.5 D5.2 | 46.75,70.5 43.5,70.5 R52.1 | 46.75,70.5 46.75,75 50.25,75 51,74.25 51,72.25 50,71.25 IC2.3
N$33
  Top 0.254: R28.2 15.5,77.5 12.25,77.5 12.25,78.75 D3.1
N$34
  Top 0.254: R29.1 15.5,92.5 12.5,92.5 12.25,92.25 9.75,92.25 9.75,94 D3.9
N$35
  Top 0.254: R30.1 15.5,95 12.25,95 12.25,94.25 D3.10
N$36
  Top 0.254: R31.1 15.5,85 8,85 8,74.25 7.75,74 2,74 2,78.75 D3.5
N$37
  Top 0.254: R32.2 95.5,115.5 101.25,115.5 101.25,118 D2.7
N$38
  Top 0.254: R33.2 95.5,118 98.75,118 D2.6
N$39
  Top 0.254: R34.2 95.5,103 97.75,103 97.75,103.75 98.75,104.75 101.25,104.75 101.25,103 D2.4
N$40  (via drill 0.3)
  Top 0.254: v102.25,105.5 95.5,105.5 R35.2
  Bottom 0.254: v102.25,105.5 102.75,105 104.5,105 106.5,103 D2.2
N$41
  Top 0.254: R36.2 95.5,108 103,108 103,99.25 103.25,99 109,99 109,102.75 D2.1
N$42  (via drill 0.3)
  Top 0.254: v102.25,113.25 102.25,113 95.5,113 R37.1
  Bottom 0.254: v102.25,113.25 106.5,117.5 106.5,118 D2.9
N$43
  Top 0.254: IC3.4 54.25,84.25 55,83.5 C8.1
N$44
  Top 0.254: C9.1 47.25,78.5 48.75,80 48.75,82.5 X1.P$2 49,82.5 50,83.5 50,85.75 IC3.1
N$45
  Top 0.254: 51.25,82.5 51.25,79 51.75,78.5 C10.1 | 51.25,82.5 X1.P$1 51.25,82.5 | IC3.2 53.25,84.5 51.25,82.5
N$46
  Top 0.254: R38.1 95.5,110.5 103,110.5 103,119.25 103.5,119.75 109,119.75 109,118.25 D2.10
N$47
  Top 0.254: R39.1 95.5,100.5 98.75,100.5 98.75,102.75 D2.5
N$48
  Top 0.254: R40.2 95.5,91 101.25,91 101.25,94 D4.7
N$49
  Top 0.254: R41.2 95.5,93.5 98.75,93.5 98.75,94 D4.6
N$50
  Top 0.254: R42.2 95.25,78.5 94.5,77.75 94.5,75.25 94.75,75 101.25,75 101.25,78.75 D4.4
N$51
  Top 0.254: R43.2 95.5,81 103,81 103,74.25 103.25,74 106.5,74 106.5,78.75 D4.2
N$52  (via drill 0.3)
  Top 0.254: v103.25,83.5 95.5,83.5 R44.2
  Bottom 0.254: v103.25,83.5 105.75,81 107.5,81 109,79.5 109,79 D4.1
N$53
  Top 0.254: R45.1 95.5,88.5 102.5,88.5 102.5,95.5 103.25,96.25 110.25,96.25 110.25,93.25 109.25,92.25 106.75,92.25 106.75,94 D4.9
N$54
  Top 0.254: R46.1 95.5,86 103,86 103,95.25 103.5,95.75 109,95.75 109,94.25 D4.10
N$55
  Top 0.254: R47.1 95.5,76 98.75,76 98.75,78.75 D4.5
N$56  (via drill 0.8)
  Top 0.5: v24.8,161.1 26.2,161.1 29.05,158.25 44.65,158.25 46.6,156.3 46.6,154.1 48.42,152.28 67.08,152.28 67.7,152.9 67.7,154.8 66.45,156.05 CV2.3
  Bottom 0.3: SV1.5 23.3,145.53 23.3,153.3 23.7,153.7 23.7,160 v24.8,161.1
N$57  (via drill 0.8)
  Top 0.5: v23,162.3 30,162.3 31.15,161.15 48.15,161.15 52.29,157.01 CV3.3
  Bottom 0.3: SV1.3 20.7,145.47 20.7,152 23,154.3 v23,162.3
N$58  (via drill 0.8)
  Top 0.5: v21.1,160.6 22.8,160.6 25.95,157.45 37.89,157.45 CV4.3
  Bottom 0.3: SV1.1 18.2,145.51 18.2,151.6 21.9,155.3 21.9,159.8 v21.1,160.6
N$59  (via drill 0.8)
  Top 0.5: v96,158.5 96.29,158.21 MIDI_OUT.3
  Bottom 0.5: SV1.10 27.08,158.18 28.2,159.3 95.2,159.3 v96,158.5
N$60  (via drill 0.8)
  Top 0.5: v85.1,160.8 85.7,160.8 86.75,159.75 MIDI_OUT.6
  Bottom 0.254: v85.1,160.8 85,160.75 85,160.8
  Bottom 0.5: SV1.8 24.54,158.54 26.8,160.8 85,160.8
N$61
  Top 0.5: SV1.6 22,150.3 23.4,151.7 23.4,155.25 22.6,156.05 MIDI_IN.3
N$62
  Top 0.5: SV1.4 19.46,151.29 13.71,157.04 MIDI_IN.6
N$67
  Top 0.254: R48.2 15.5,100.5 15.5,97 15,96.5 6.25,96.5 6.25,97.75 T1.B
N$68
  Top 0.254: R49.2 95.5,98 103,98 T2.B
N$69
  Top 0.254: R50.2 95.5,73.5 103,73.5 103,73 T4.B
N$70
  Top 0.254: R51.2 15.5,75 15.5,74.75 12.5,71.75 6.25,71.75 6.25,72.75 T3.B
N$71
  Top 0.254: R7.1 33.5,39.5 35,39.5 R8.2 35.25,39.5 36.5,38.25 39.75,38.25 IC4.2
N$75
  Top 0.254: T3.C 7,75.25 7,78.75 D3.3 7,79 7,94 D3.8
N$77
  Top 0.254: T4.C 104,75.25 104,78.75 D4.3 104,79 104,94 D4.8
N$79
  Top 0.254: T2.C 104,100.25 104,102.75 D2.3 104,103 104,118 D2.8
N$81
  Top 0.254: T1.C 7,100.25 7,102.75 D1.3 7,103 7,118 D1.8
OUT_RING
  Top 0.254: S3.6 32,54 32,53.25 31.75,53 28.5,53 28.5,57.25 S3.1 33.25,62 33.25,75 34.5,76.25 SV3.8
OUT_SINK
  Top 0.254: S3.5 37.5,54.75 37.5,53.25 37,52.75 37,52 28,52 23.5,56.5 R55.2
OUT_SRC  (via drill 0.3)
  Top 0.254: v37.5,56.75 40,56.75 R56.1 | v34,59 31.5,56.5 S3.2
  Bottom 0.254: v37.5,56.75 35.25,59 v34,59
OUT_TIP
  Top 0.254: 35.25,59 S3.3 | 35.25,59 S3.4 35.25,59 | 35.25,59 35.25,73.25 34.75,73.75 SV3.10
P  (via drill 0.3)
  Top 0.254: v17.25,86.25 17.25,85 R31.2 | v17.25,109.25 17.25,110.5 R23.2 | v89.75,97 89.75,79.75 93.5,76 R47.2 93.75,76 93.75,75.25 94.5,74.5 94.5,72.5 85.5,72.5 v75.75,82.25 | v93.5,99.25 93.5,100.5 R39.2 | v60.75,83.25 58.75,85.25 | 58.75,85.25 IC3.12 | v59,85.75 58.75,85.5 58.75,85.25
  Bottom 0.254: v17.25,109.25 15.25,109.25 15.25,106.5 15.5,106.25 15.5,88 v17.25,86.25 17.75,85.75 v59,85.75 | v89.75,97 92,99.25 v93.5,99.25 | v60.75,83.25 61.75,82.25 v75.75,82.25
PGND  (via drill 0.8)
  other vias: 49.25,153.75 57.25,156.25 67.75,163.25 83.5,163.5 96.5,142.75 65.75,142.5 34.25,154 41.5,163 17,159.75 12.75,152 42,156.75 89.75,156.25 96.75,162.5
  pour Top: 9,165.5 100,165.5 100,140.5 9,140.5
  pour Bottom: 9,140.5 9,163.5 arc-90 11,165.5 99,165.5 99,140.5
RST_PCB  (via drill 0.3)
  Top 0.254: 49,91.5 49,93.5 C11.1 | 49,91.5 R14.2 49,91.5 | IC3.40 v50,91.25 49,91.25 49,91.5 | SW1.1 80.5,90.25 74.5,90.25 SW1.2 74.25,90.25 74.25,91.25 v70.25,91.25
  Bottom 0.254: v70.25,91.25 v50,91.25
RX  (via drill 0.3)
  Top 0.254: v57.5,72.5 56.25,72.5 IC2.5 | v61.25,72.75 61.5,73 61.5,88 60.75,88.75 IC3.16
  Bottom 0.254: v57.5,72.5 57.75,72.75 v61.25,72.75
SW1  (via drill 0.3)
  Top 0.254: IC3.19 64,90.25 64,86.25 63,85.25 63,60.75 v61.75,59.5 | v48,45.75 36,45.75 36,41.25 35.25,40.5 4.5,40.5 S1.P$3 S1.P$4
  Bottom 0.254: v48,45.75 v61.75,59.5
SW2  (via drill 0.3)
  Top 0.254: IC3.20 67,90.75 v67,90 | v68.25,88.75 100.75,56.25 101.5,56.25 S2.P$3 S2.P$4
  Bottom 0.254: v68.25,88.75 v67,90
SWC  (via drill 0.3)
  Top 0.254: v48.75,84.5 48.75,85.75 49.75,86.75 49.75,88.07 50.37,88.69 51.2,88.69 IC3.45 | v64.25,81.5 74.75,81.5 v100.75,55.5
  Bottom 0.254: v48.75,84.5 51.75,81.5 v64.25,81.5 | v100.75,55.5 102.25,54 106.75,54 107,53.75 SV2.3
SWD  (via drill 0.3)
  Top 0.254: IC3.46 52.5,88.25 v52.5,88.5 | v46.25,88.5 46.25,77.75 46.5,77.5 54.75,77.5 v54.75,77.75 | v64.25,78.5 87.25,55.5 v99.75,55.5
  Bottom 0.254: v46.25,88.5 v52.5,88.5 | v54.75,77.75 55.5,78.5 v64.25,78.5 | v99.75,55.5 100.75,56.5 107,56.5 SV2.2
TX  (via drill 0.3)
  Top 0.254: IC3.15 56.5,88.25 v56.5,87.5 | v41.75,87.25 25.5,87.25 25.5,61.5 23.5,59.5 R55.1
  Bottom 0.254: v56.5,87.5 56.25,87.25 v41.75,87.25
USB_D+  (via drill 0.3)
  Top 0.254: v53.75,96.25 IC3.34 | v59,101.5 58.75,101.75 58.75,116.75 54.75,120.75 X2.B6 54.75,129 55.5,129 55.75,128.75 X2.A6
  Bottom 0.254: v59,101.5 v53.75,96.25
USB_D-
  Top 0.254: IC3.33 54.25,95.25 56.5,97.5 57.25,97.5 57.25,100 55.5,101.75 49.25,101.75 49.25,128.5 51,130.25 60.75,130.25 60.75,126 57.5,122.75 57.5,121.25 57.25,121 55.25,121 55.25,125.75 | X2.A7 55.25,125.75 | X2.B7 56.25,126.75 55.25,125.75

### Text on the board
tPlace: to main board | v1.1 | red stripe | fade4 / jack board | RESET | red stripe | v1.1 | to jack board | PROG | MIDI OUT | MIDI IN | 3v3 / SWD / SWC / GND | B | fade4 / main board | A | 1/8" MIDI STANDARDS: / Type B: Arturia, Novation, ALM|Busy Circuits / Type A: Korg, Make Noise, Akai / / Use Switch to Select between A and B
tNames: double tap to enter disk mode
bNames: midi in | CV4 | CV3 | CV2 | CV1 | midi out